# EAGLE schematic eps (EAGLE 9.6.2)

## Sheet 1 of 14
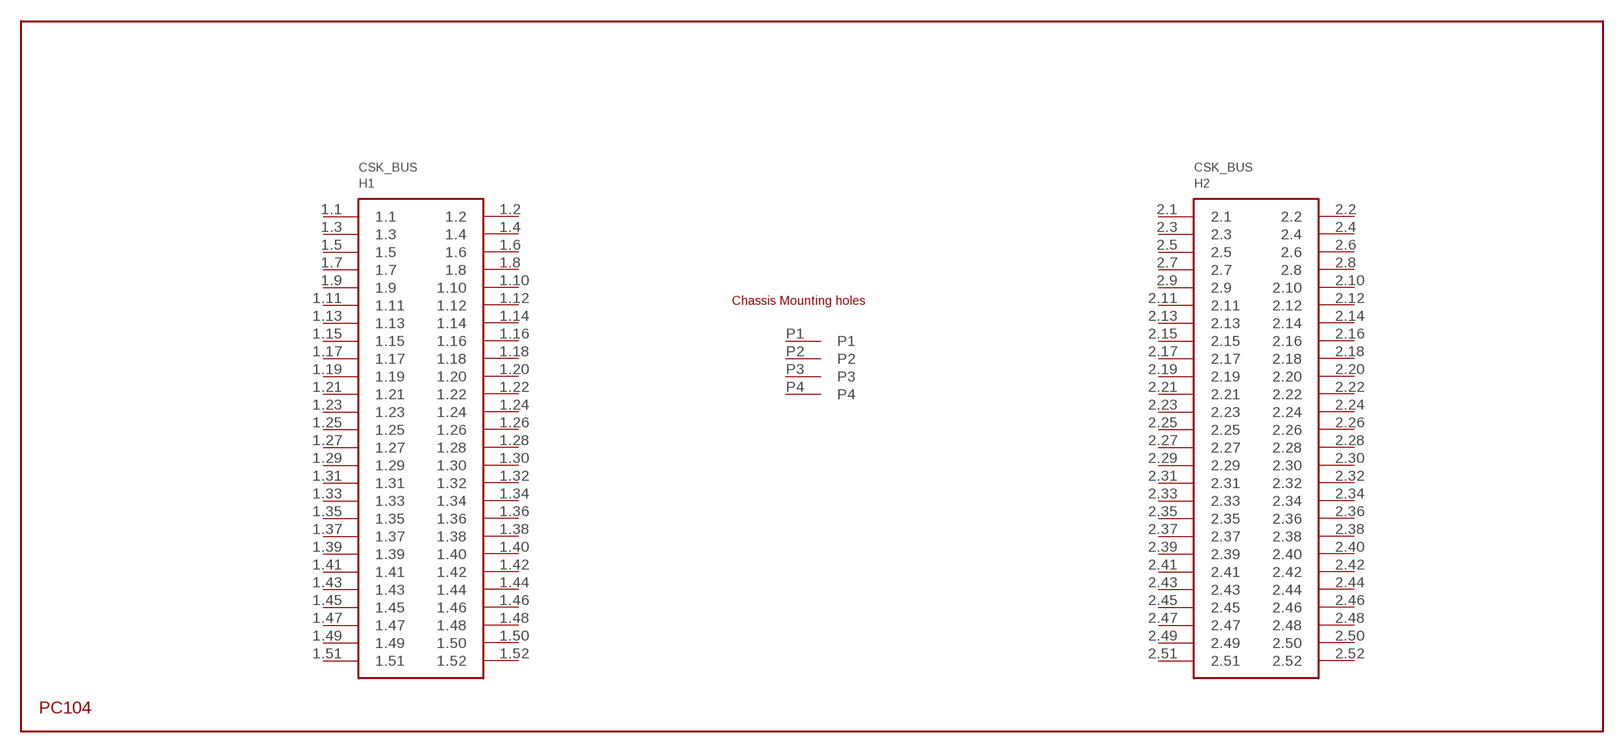
[diagram p0: schematic, sheet 1]

### Parts
H1  PC104_WCONN  [PC104_WCONN]
Unconnected: H1.1.1 H1.1.2 H1.1.3 H1.1.4 H1.1.5 H1.1.6 H1.1.7 H1.1.8 H1.1.9 H1.1.10 H1.1.11 H1.1.12 H1.1.13 H1.1.14 H1.1.15 H1.1.16 H1.1.17 H1.1.18 H1.1.19 H1.1.20 H1.1.21 H1.1.22 H1.1.23 H1.1.24 H1.1.25 H1.1.26 H1.1.27 H1.1.28 H1.1.29 H1.1.30 H1.1.31 H1.1.32 H1.1.33 H1.1.34 H1.1.35 H1.1.36 H1.1.37 H1.1.38 H1.1.39 H1.1.40 H1.1.41 H1.1.42 H1.1.43 H1.1.44 H1.1.45 H1.1.46 H1.1.47 H1.1.48 H1.1.49 H1.1.50 H1.1.51 H1.1.52 H1.2.1 H1.2.2 H1.2.3 H1.2.4 H1.2.5 H1.2.6 H1.2.7 H1.2.8 H1.2.9 H1.2.10 H1.2.11 H1.2.12 H1.2.13 H1.2.14 H1.2.15 H1.2.16 H1.2.17 H1.2.18 H1.2.19 H1.2.20 H1.2.21 H1.2.22 H1.2.23 H1.2.24 H1.2.25 H1.2.26 H1.2.27 H1.2.28 H1.2.29 H1.2.30 H1.2.31 H1.2.32 H1.2.33 H1.2.34 H1.2.35 H1.2.36 H1.2.37 H1.2.38 H1.2.39 H1.2.40 H1.2.41 H1.2.42 H1.2.43 H1.2.44 H1.2.45 H1.2.46 H1.2.47 H1.2.48 H1.2.49 H1.2.50 H1.2.51 H1.2.52 H1.P1 H1.P2 H1.P3 H1.P4

## Sheet 2 of 14
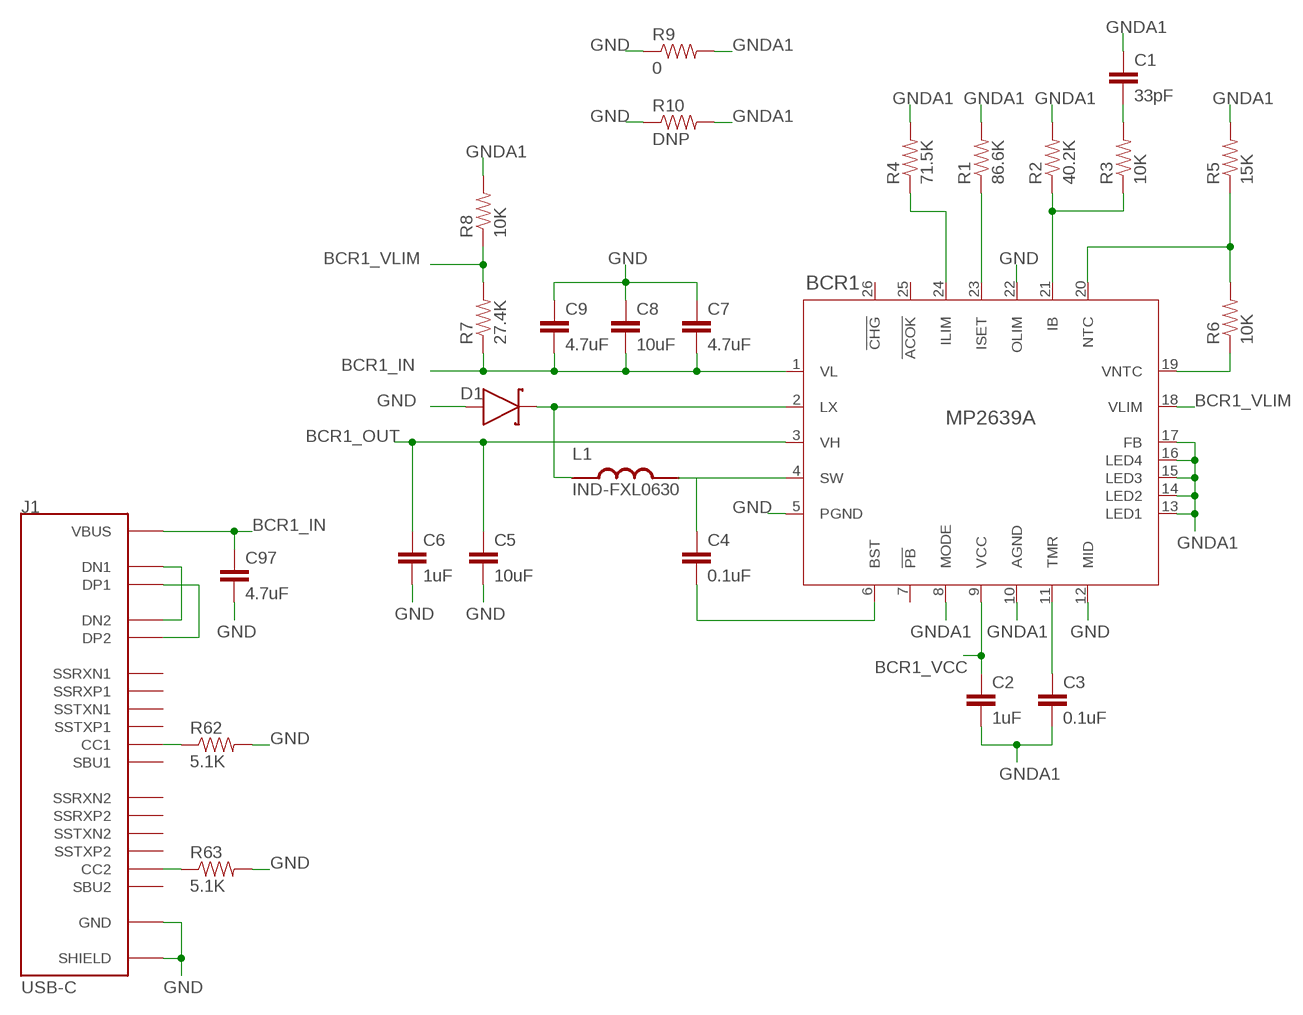
[diagram p1: schematic, sheet 2]

### Parts
BCR1  MP2639A  [IC26_MP2639A_MNP]
C1  33pF  CAP0603-CAP  [0603-CAP]
C2  1uF  CAP0603-CAP  [0603-CAP]
C3  0.1uF  CAP0603-CAP  [0603-CAP]
C4  0.1uF  CAP0603-CAP  [0603-CAP]
C5  10uF  CAP0603-CAP  [0603-CAP]
C6  1uF  CAP0603-CAP  [0603-CAP]
C7  4.7uF  CAP0603-CAP  [0603-CAP]
C8  10uF  CAP0603-CAP  [0603-CAP]
C9  4.7uF  CAP0603-CAP  [0603-CAP]
C97  4.7uF  CAP0603-CAP  [0603-CAP]
D1  DIODE-SOD123  [SOD123]
J1  USB-C  [CUI_UJ31-CH-G1-SMT-TR]
L1  IND-FXL0630  [FXL0630]
R1  86.6K  RESISTOR0603-RES  [0603-RES]
R2  40.2K  RESISTOR0603-RES  [0603-RES]
R3  10K  RESISTOR0603-RES  [0603-RES]
R4  71.5K  RESISTOR0603-RES  [0603-RES]
R5  15K  RESISTOR0603-RES  [0603-RES]
R6  10K  RESISTOR0603-RES  [0603-RES]
R7  27.4K  RESISTOR0603-RES  [0603-RES]
R8  10K  RESISTOR0603-RES  [0603-RES]
R9  0  RESISTOR0603-RES  [0603-RES]
R10  DNP  RESISTOR0603-RES  [0603-RES]
R62  5.1K  RESISTOR0603-RES  [0603-RES]
R63  5.1K  RESISTOR0603-RES  [0603-RES]

### Nets
BCR1_BST: BCR1.6(BST) C4.2
BCR1_C1-R3: C1.2 R3.2
BCR1_IB: BCR1.21(IB) R2.1 R3.1
BCR1_ILIM: BCR1.24(ILIM) R4.1
BCR1_IN: BCR1.1(VL) C7.2 C8.2 C9.2 C97.1 J1.A4(VBUS) J1.A9(VBUS) J1.B4(VBUS) J1.B9(VBUS) R7.1 ; also sheet 3
BCR1_ISET: BCR1.23(ISET) R1.1
BCR1_LX: BCR1.2(LX) D1.1 L1.1
BCR1_NTC: BCR1.20(NTC) R5.1 R6.2
BCR1_OUT: BCR1.3(VH) C5.1 C6.1
BCR1_SW: BCR1.4(SW) C4.1 L1.2
BCR1_TMR: BCR1.11(TMR) C3.1
BCR1_VCC: BCR1.9(VCC) C2.1
BCR1_VLIM: BCR1.18(VLIM) R7.2 R8.1
BCR1_VNTC: BCR1.19(VNTC) R6.1
GND: BCR1.5(PGND) BCR1.12(MID) BCR1.22(OLIM) C5.2 C6.2 C7.1 C8.1 C9.1 C97.2 D1.2 J1.A1(GND) J1.A12(GND) J1.B1(GND) J1.B12(GND) J1.SH1(SHIELD) J1.SH2(SHIELD) J1.SH3(SHIELD) J1.SH4(SHIELD) J1.SH5(SHIELD) J1.SH6(SHIELD) R9.1 R10.1 R62.2 R63.2 ; also sheet 3,4,5,6,7,8,9,10,11,12,13,14
GNDA1: BCR1.8(MODE) BCR1.10(AGND) BCR1.13(LED1) BCR1.14(LED2) BCR1.15(LED3) BCR1.16(LED4) BCR1.17(FB) C1.1 C2.2 C3.2 R1.2 R2.2 R4.2 R5.2 R8.2 R9.2 R10.2
J1_CC1: J1.A5(CC1) R62.1
J1_CC2: J1.B5(CC2) R63.1
J1_DN: J1.A7(DN1) J1.B7(DN2)
J1_DP: J1.A6(DP1) J1.B6(DP2)
Unconnected: BCR1.7(!PB) BCR1.25(!ACOK) BCR1.26(!CHG) J1.A2(SSTXP1) J1.A3(SSTXN1) J1.A8(SBU1) J1.A10(SSRXN2) J1.A11(SSRXP2) J1.B2(SSTXP2) J1.B3(SSTXN2) J1.B8(SBU2) J1.B10(SSRXN1) J1.B11(SSRXP1)

## Sheet 3 of 14
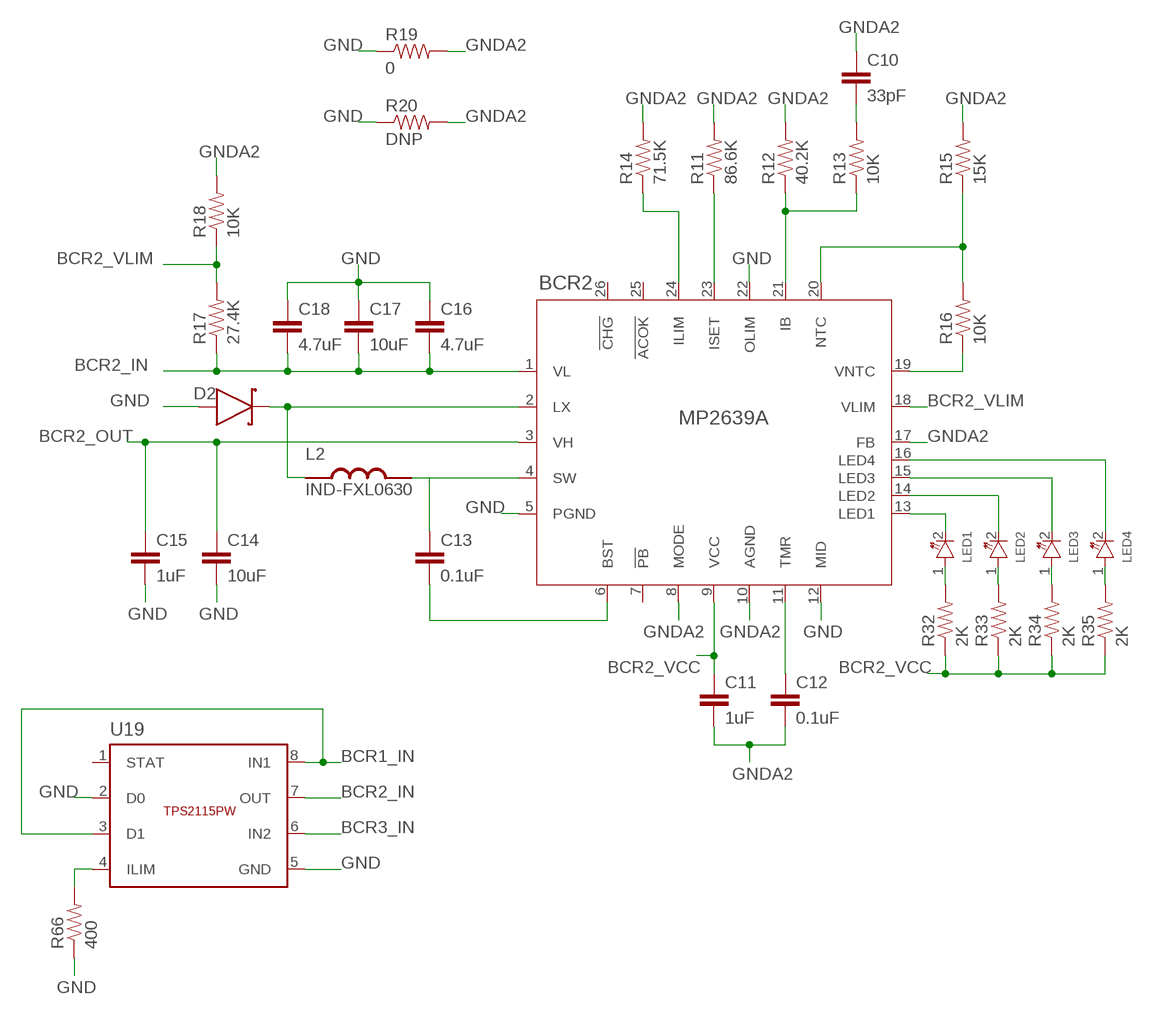
[diagram p2: schematic, sheet 3]

### Parts
BCR2  MP2639A  [IC26_MP2639A_MNP]
C10  33pF  CAP0603-CAP  [0603-CAP]
C11  1uF  CAP0603-CAP  [0603-CAP]
C12  0.1uF  CAP0603-CAP  [0603-CAP]
C13  0.1uF  CAP0603-CAP  [0603-CAP]
C14  10uF  CAP0603-CAP  [0603-CAP]
C15  1uF  CAP0603-CAP  [0603-CAP]
C16  4.7uF  CAP0603-CAP  [0603-CAP]
C17  10uF  CAP0603-CAP  [0603-CAP]
C18  4.7uF  CAP0603-CAP  [0603-CAP]
D2  DIODE-SOD123  [SOD123]
L2  IND-FXL0630  [FXL0630]
LED1  LED_0805  [LED_0805]
LED2  LED_0805  [LED_0805]
LED3  LED_0805  [LED_0805]
LED4  LED_0805  [LED_0805]
R11  86.6K  RESISTOR0603-RES  [0603-RES]
R12  40.2K  RESISTOR0603-RES  [0603-RES]
R13  10K  RESISTOR0603-RES  [0603-RES]
R14  71.5K  RESISTOR0603-RES  [0603-RES]
R15  15K  RESISTOR0603-RES  [0603-RES]
R16  10K  RESISTOR0603-RES  [0603-RES]
R17  27.4K  RESISTOR0603-RES  [0603-RES]
R18  10K  RESISTOR0603-RES  [0603-RES]
R19  0  RESISTOR0603-RES  [0603-RES]
R20  DNP  RESISTOR0603-RES  [0603-RES]
R32  2K  RESISTOR0603-RES  [0603-RES]
R33  2K  RESISTOR0603-RES  [0603-RES]
R34  2K  RESISTOR0603-RES  [0603-RES]
R35  2K  RESISTOR0603-RES  [0603-RES]
R66  400  RESISTOR0603-RES  [0603-RES]
U19  TPS2115PW  [TTSOP-8]

### Nets
BCR1_IN: U19.3(D1) U19.8(IN1) ; also sheet 2
BCR2_BST: BCR2.6(BST) C13.2
BCR2_C10-R13: C10.2 R13.2
BCR2_IB2: BCR2.21(IB) R12.1 R13.1
BCR2_ILIM: BCR2.24(ILIM) R14.1
BCR2_IN: BCR2.1(VL) C16.2 C17.2 C18.2 R17.1 U19.7(OUT)
BCR2_ISET: BCR2.23(ISET) R11.1
BCR2_LED1: BCR2.13(LED1) LED1.2
BCR2_LED2: BCR2.14(LED2) LED2.2
BCR2_LED3: BCR2.15(LED3) LED3.2
BCR2_LED4: BCR2.16(LED4) LED4.2
BCR2_LX: BCR2.2(LX) D2.1 L2.1
BCR2_NTC: BCR2.20(NTC) R15.1 R16.2
BCR2_OUT: BCR2.3(VH) C14.1 C15.1
BCR2_SW: BCR2.4(SW) C13.1 L2.2
BCR2_TMR: BCR2.11(TMR) C12.1
BCR2_VCC: BCR2.9(VCC) C11.1 R32.1 R33.1 R34.1 R35.1
BCR2_VLIM: BCR2.18(VLIM) R17.2 R18.1
BCR2_VNTC: BCR2.19(VNTC) R16.1
BCR3_IN: U19.6(IN2) ; also sheet 4
GND: BCR2.5(PGND) BCR2.12(MID) BCR2.22(OLIM) C14.2 C15.2 C16.1 C17.1 C18.1 D2.2 R19.1 R20.1 R66.1 U19.2(D0) U19.5(GND) ; also sheet 2,4,5,6,7,8,9,10,11,12,13,14
GNDA2: BCR2.8(MODE) BCR2.10(AGND) BCR2.17(FB) C10.1 C11.2 C12.2 R11.2 R12.2 R14.2 R15.2 R18.2 R19.2 R20.2
LED1: LED1.1 R32.2
LED2: LED2.1 R33.2
LED3: LED3.1 R34.2
LED4: LED4.1 R35.2
U19_ILIM: R66.2 U19.4(ILIM)
Unconnected: BCR2.7(!PB) BCR2.25(!ACOK) BCR2.26(!CHG) U19.1(STAT)

## Sheet 4 of 14
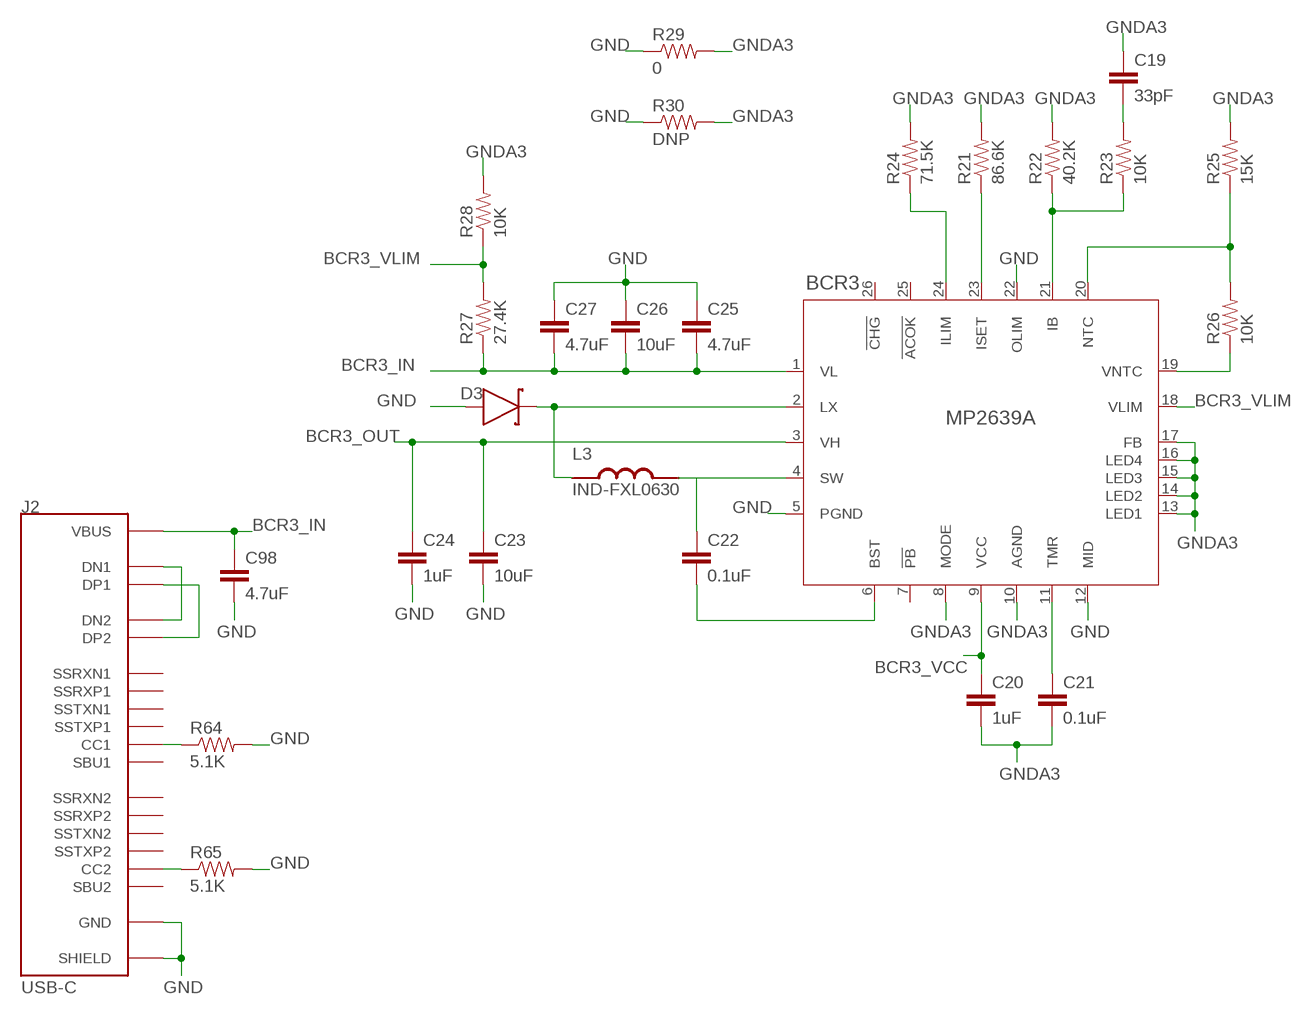
[diagram p3: schematic, sheet 4]

### Parts
BCR3  MP2639A  [IC26_MP2639A_MNP]
C19  33pF  CAP0603-CAP  [0603-CAP]
C20  1uF  CAP0603-CAP  [0603-CAP]
C21  0.1uF  CAP0603-CAP  [0603-CAP]
C22  0.1uF  CAP0603-CAP  [0603-CAP]
C23  10uF  CAP0603-CAP  [0603-CAP]
C24  1uF  CAP0603-CAP  [0603-CAP]
C25  4.7uF  CAP0603-CAP  [0603-CAP]
C26  10uF  CAP0603-CAP  [0603-CAP]
C27  4.7uF  CAP0603-CAP  [0603-CAP]
C98  4.7uF  CAP0603-CAP  [0603-CAP]
D3  DIODE-SOD123  [SOD123]
J2  USB-C  [CUI_UJ31-CH-G1-SMT-TR]
L3  IND-FXL0630  [FXL0630]
R21  86.6K  RESISTOR0603-RES  [0603-RES]
R22  40.2K  RESISTOR0603-RES  [0603-RES]
R23  10K  RESISTOR0603-RES  [0603-RES]
R24  71.5K  RESISTOR0603-RES  [0603-RES]
R25  15K  RESISTOR0603-RES  [0603-RES]
R26  10K  RESISTOR0603-RES  [0603-RES]
R27  27.4K  RESISTOR0603-RES  [0603-RES]
R28  10K  RESISTOR0603-RES  [0603-RES]
R29  0  RESISTOR0603-RES  [0603-RES]
R30  DNP  RESISTOR0603-RES  [0603-RES]
R64  5.1K  RESISTOR0603-RES  [0603-RES]
R65  5.1K  RESISTOR0603-RES  [0603-RES]

### Nets
BCR3_BST: BCR3.6(BST) C22.2
BCR3_C19-R23: C19.2 R23.2
BCR3_IB: BCR3.21(IB) R22.1 R23.1
BCR3_ILIM: BCR3.24(ILIM) R24.1
BCR3_IN: BCR3.1(VL) C25.2 C26.2 C27.2 C98.1 J2.A4(VBUS) J2.A9(VBUS) J2.B4(VBUS) J2.B9(VBUS) R27.1 ; also sheet 3
BCR3_ISET: BCR3.23(ISET) R21.1
BCR3_LX: BCR3.2(LX) D3.1 L3.1
BCR3_NTC: BCR3.20(NTC) R25.1 R26.2
BCR3_OUT: BCR3.3(VH) C23.1 C24.1
BCR3_SW: BCR3.4(SW) C22.1 L3.2
BCR3_TMR: BCR3.11(TMR) C21.1
BCR3_VCC: BCR3.9(VCC) C20.1
BCR3_VLIM: BCR3.18(VLIM) R27.2 R28.1
BCR3_VNTC: BCR3.19(VNTC) R26.1
GND: BCR3.5(PGND) BCR3.12(MID) BCR3.22(OLIM) C23.2 C24.2 C25.1 C26.1 C27.1 C98.2 D3.2 J2.A1(GND) J2.A12(GND) J2.B1(GND) J2.B12(GND) J2.SH1(SHIELD) J2.SH2(SHIELD) J2.SH3(SHIELD) J2.SH4(SHIELD) J2.SH5(SHIELD) J2.SH6(SHIELD) R29.1 R30.1 R64.2 R65.2 ; also sheet 2,3,5,6,7,8,9,10,11,12,13,14
GNDA3: BCR3.8(MODE) BCR3.10(AGND) BCR3.13(LED1) BCR3.14(LED2) BCR3.15(LED3) BCR3.16(LED4) BCR3.17(FB) C19.1 C20.2 C21.2 R21.2 R22.2 R24.2 R25.2 R28.2 R29.2 R30.2
J2_CC1: J2.A5(CC1) R64.1
J2_CC2: J2.B5(CC2) R65.1
J2_DN: J2.A7(DN1) J2.B7(DN2)
J2_DP: J2.A6(DP1) J2.B6(DP2)
Unconnected: BCR3.7(!PB) BCR3.25(!ACOK) BCR3.26(!CHG) J2.A2(SSTXP1) J2.A3(SSTXN1) J2.A8(SBU1) J2.A10(SSRXN2) J2.A11(SSRXP2) J2.B2(SSTXP2) J2.B3(SSTXN2) J2.B8(SBU2) J2.B10(SSRXN1) J2.B11(SSRXP1)

## Sheet 5 of 14
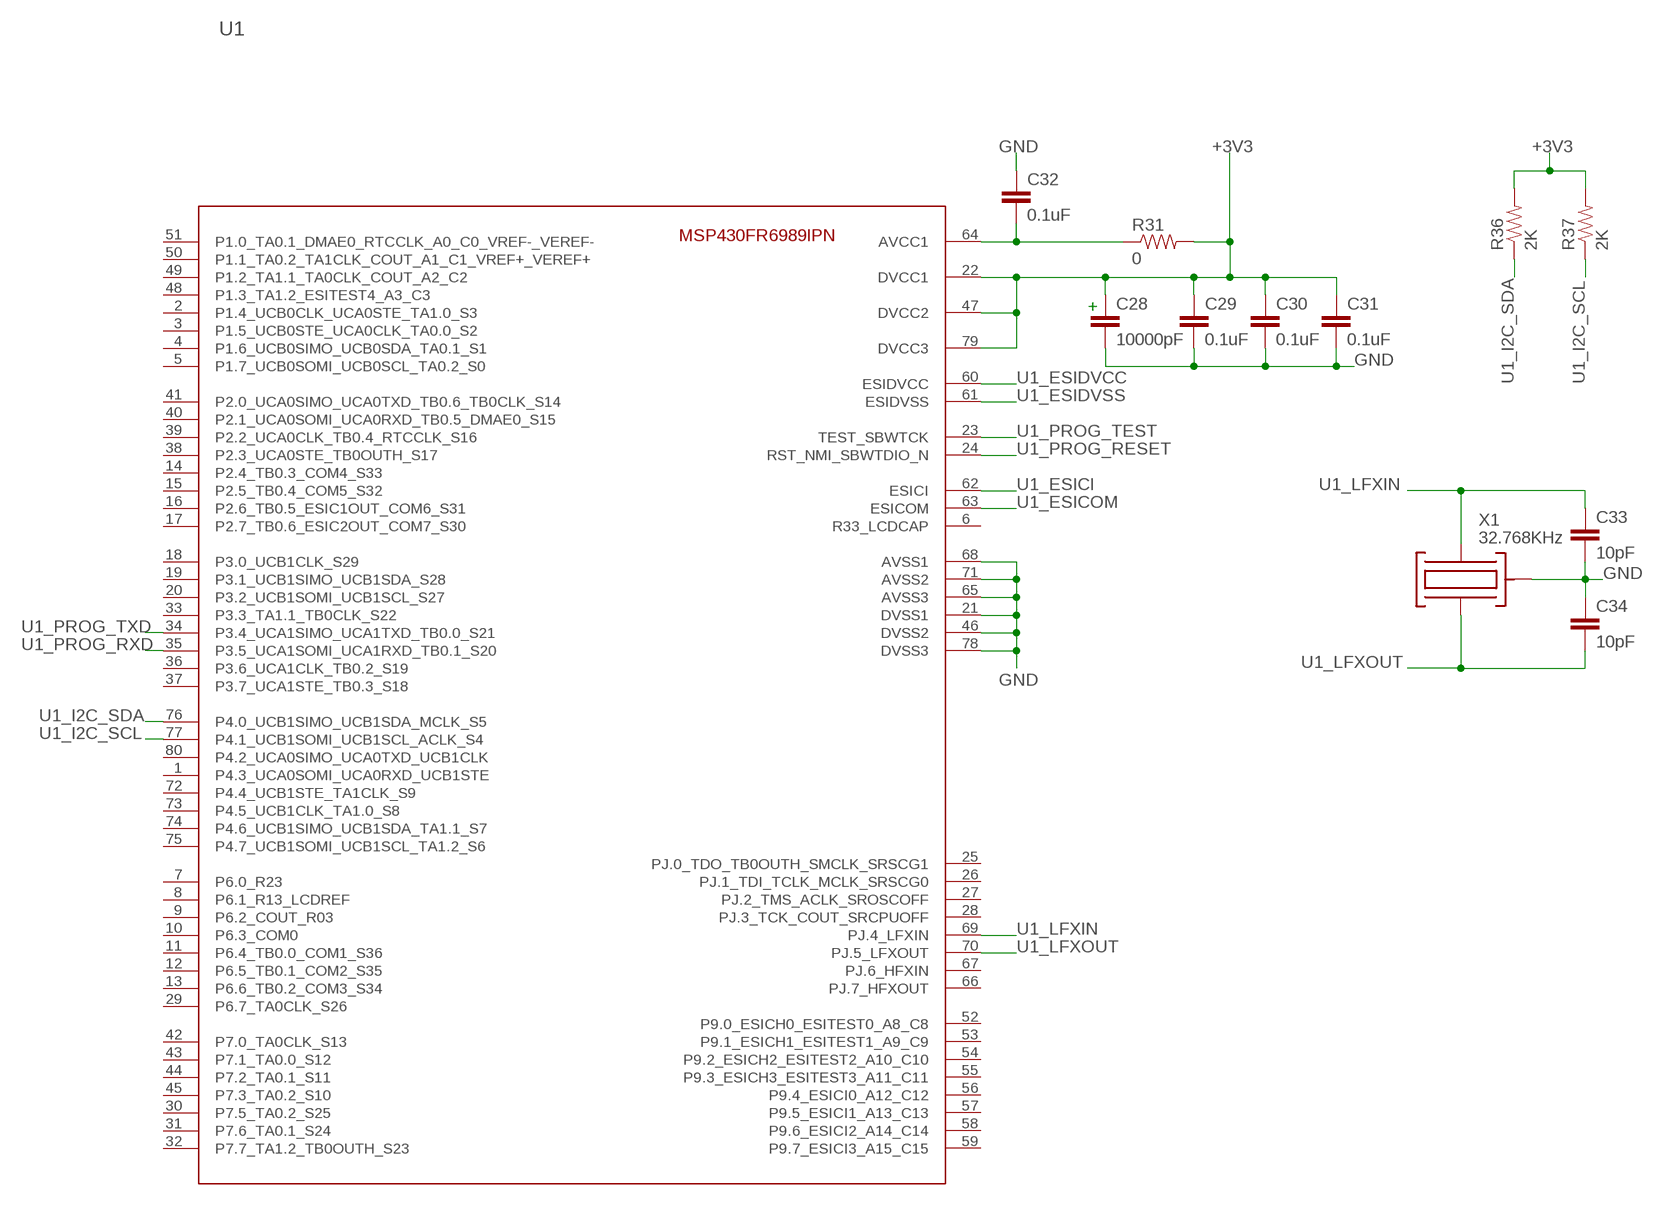
[diagram p4: schematic, sheet 5]

### Parts
C28  10000pF  CAP0805  [0805]
C29  0.1uF  CAP0603-CAP  [0603-CAP]
C30  0.1uF  CAP0603-CAP  [0603-CAP]
C31  0.1uF  CAP0603-CAP  [0603-CAP]
C32  0.1uF  CAP0603-CAP  [0603-CAP]
C33  10pF  CAP0603-CAP  [0603-CAP]
C34  10pF  CAP0603-CAP  [0603-CAP]
R31  0  RESISTOR0603-RES  [0603-RES]
R36  2K  RESISTOR0603-RES  [0603-RES]
R37  2K  RESISTOR0603-RES  [0603-RES]
U1  MSP430FR6989IPN  [PN0080A_N]
X1  32.768KHz  MS3V-T1R  [MS3V-T1R]

### Nets
+3V3: C28.1 C29.1 C30.1 C31.1 R31.2 R36.2 R37.2 U1.22(DVCC1) U1.47(DVCC2) U1.79(DVCC3) ; also sheet 6
GND: C28.2 C29.2 C30.2 C31.2 C32.1 C33.2 C34.1 U1.21(DVSS1) U1.46(DVSS2) U1.65(AVSS3) U1.68(AVSS1) U1.71(AVSS2) U1.78(DVSS3) X1.3 ; also sheet 2,3,4,6,7,8,9,10,11,12,13,14
N$3: C32.2 R31.1 U1.64(AVCC1)
U1_ESICI: U1.62(ESICI)
U1_ESICOM: U1.63(ESICOM)
U1_ESIDVCC: U1.60(ESIDVCC)
U1_ESIDVSS: U1.61(ESIDVSS)
U1_I2C_SCL: R37.1 U1.77(P4.1_UCB1SOMI_UCB1SCL_ACLK_S4)
U1_I2C_SDA: R36.1 U1.76(P4.0_UCB1SIMO_UCB1SDA_MCLK_S5)
U1_LFXIN: C33.1 U1.69(PJ.4_LFXIN) X1.1
U1_LFXOUT: C34.2 U1.70(PJ.5_LFXOUT) X1.2
U1_PROG_RESET: U1.24(RST_NMI_SBWTDIO_N)
U1_PROG_RXD: U1.35(P3.5_UCA1SOMI_UCA1RXD_TB0.1_S20)
U1_PROG_TEST: U1.23(TEST_SBWTCK)
U1_PROG_TXD: U1.34(P3.4_UCA1SIMO_UCA1TXD_TB0.0_S21)
Unconnected: U1.1(P4.3_UCA0SOMI_UCA0RXD_UCB1STE) U1.2(P1.4_UCB0CLK_UCA0STE_TA1.0_S3) U1.3(P1.5_UCB0STE_UCA0CLK_TA0.0_S2) U1.4(P1.6_UCB0SIMO_UCB0SDA_TA0.1_S1) U1.5(P1.7_UCB0SOMI_UCB0SCL_TA0.2_S0) U1.6(R33_LCDCAP) U1.7(P6.0_R23) U1.8(P6.1_R13_LCDREF) U1.9(P6.2_COUT_R03) U1.10(P6.3_COM0) U1.11(P6.4_TB0.0_COM1_S36) U1.12(P6.5_TB0.1_COM2_S35) U1.13(P6.6_TB0.2_COM3_S34) U1.14(P2.4_TB0.3_COM4_S33) U1.15(P2.5_TB0.4_COM5_S32) U1.16(P2.6_TB0.5_ESIC1OUT_COM6_S31) U1.17(P2.7_TB0.6_ESIC2OUT_COM7_S30) U1.18(P3.0_UCB1CLK_S29) U1.19(P3.1_UCB1SIMO_UCB1SDA_S28) U1.20(P3.2_UCB1SOMI_UCB1SCL_S27) U1.25(PJ.0_TDO_TB0OUTH_SMCLK_SRSCG1) U1.26(PJ.1_TDI_TCLK_MCLK_SRSCG0) U1.27(PJ.2_TMS_ACLK_SROSCOFF) U1.28(PJ.3_TCK_COUT_SRCPUOFF) U1.29(P6.7_TA0CLK_S26) U1.30(P7.5_TA0.2_S25) U1.31(P7.6_TA0.1_S24) U1.32(P7.7_TA1.2_TB0OUTH_S23) U1.33(P3.3_TA1.1_TB0CLK_S22) U1.36(P3.6_UCA1CLK_TB0.2_S19) U1.37(P3.7_UCA1STE_TB0.3_S18) U1.38(P2.3_UCA0STE_TB0OUTH_S17) U1.39(P2.2_UCA0CLK_TB0.4_RTCCLK_S16) U1.40(P2.1_UCA0SOMI_UCA0RXD_TB0.5_DMAE0_S15) U1.41(P2.0_UCA0SIMO_UCA0TXD_TB0.6_TB0CLK_S14) U1.42(P7.0_TA0CLK_S13) U1.43(P7.1_TA0.0_S12) U1.44(P7.2_TA0.1_S11) U1.45(P7.3_TA0.2_S10) U1.48(P1.3_TA1.2_ESITEST4_A3_C3) U1.49(P1.2_TA1.1_TA0CLK_COUT_A2_C2) U1.50(P1.1_TA0.2_TA1CLK_COUT_A1_C1_VREF+_VEREF+) U1.51(P1.0_TA0.1_DMAE0_RTCCLK_A0_C0_VREF-_VEREF-) U1.52(P9.0_ESICH0_ESITEST0_A8_C8) U1.53(P9.1_ESICH1_ESITEST1_A9_C9) U1.54(P9.2_ESICH2_ESITEST2_A10_C10) U1.55(P9.3_ESICH3_ESITEST3_A11_C11) U1.56(P9.4_ESICI0_A12_C12) U1.57(P9.5_ESICI1_A13_C13) U1.58(P9.6_ESICI2_A14_C14) U1.59(P9.7_ESICI3_A15_C15) U1.66(PJ.7_HFXOUT) U1.67(PJ.6_HFXIN) U1.72(P4.4_UCB1STE_TA1CLK_S9) U1.73(P4.5_UCB1CLK_TA1.0_S8) U1.74(P4.6_UCB1SIMO_UCB1SDA_TA1.1_S7) U1.75(P4.7_UCB1SOMI_UCB1SCL_TA1.2_S6) U1.80(P4.2_UCA0SIMO_UCA0TXD_UCB1CLK)

### Notes on the sheet
- +

## Sheet 6 of 14
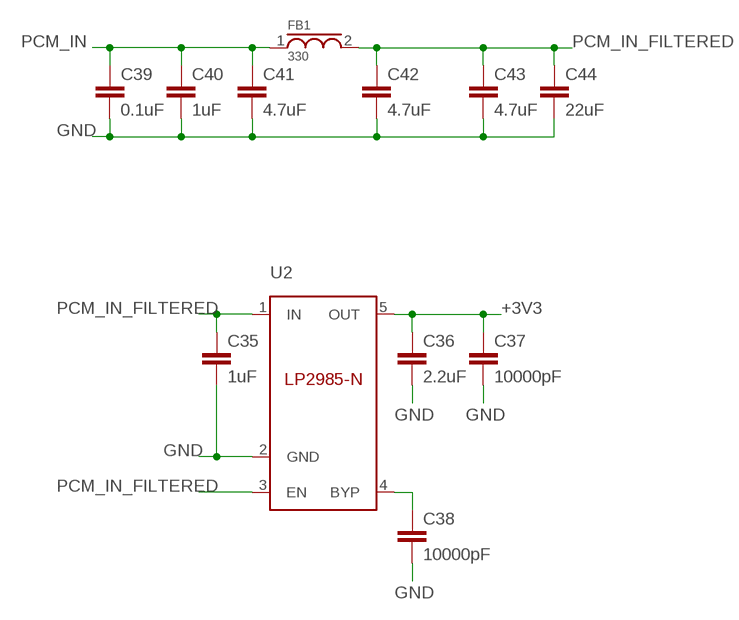
[diagram p5: schematic, sheet 6]

### Parts
C35  1uF  CAP0603-CAP  [0603-CAP]
C36  2.2uF  CAP0603-CAP  [0603-CAP]
C37  10000pF  CAP0603-CAP  [0603-CAP]
C38  10000pF  CAP0603-CAP  [0603-CAP]
C39  0.1uF  CAP0603-CAP  [0603-CAP]
C40  1uF  CAP0603-CAP  [0603-CAP]
C41  4.7uF  CAP1206  [1206]
C42  4.7uF  CAP1206  [1206]
C43  4.7uF  CAP1206  [1206]
C44  22uF  CAP_TANTALUM  [2917]
FB1  330  FB0805  [0805]
U2  LP2985-N  [SOT23-5]

### Nets
+3V3: C36.1 C37.1 U2.5(OUT) ; also sheet 5
GND: C35.2 C36.2 C37.2 C38.2 C39.2 C40.2 C41.2 C42.2 C43.2 C44.2 U2.2(GND) ; also sheet 2,3,4,5,7,8,9,10,11,12,13,14
N$4: C38.1 U2.4(BYP)
PCM_IN: C39.1 C40.1 C41.1 FB1.1
PCM_IN_FILTERED: C35.1 C42.1 C43.1 C44.1 FB1.2 U2.1(IN) U2.3(EN) ; also sheet 7,8,9,10,11,12

## Sheet 7 of 14
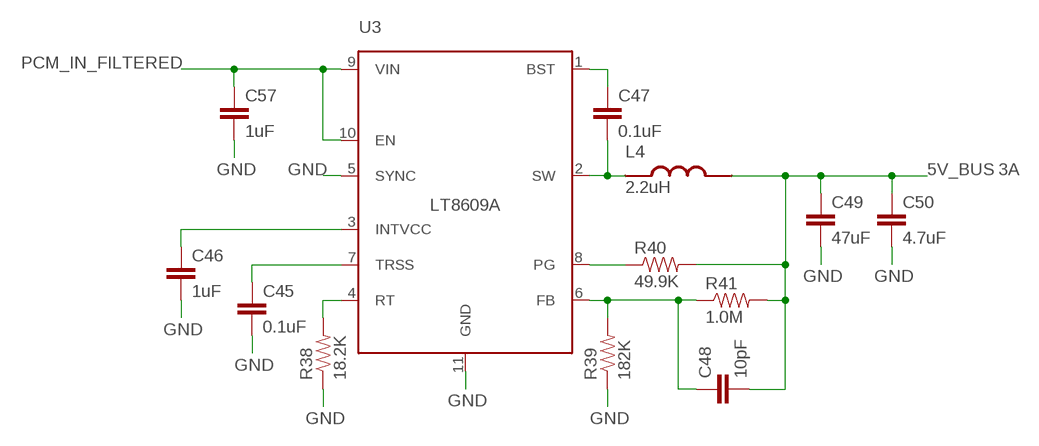
[diagram p6: schematic, sheet 7]

### Parts
C45  0.1uF  CAP0603-CAP  [0603-CAP]
C46  1uF  CAP0603-CAP  [0603-CAP]
C47  0.1uF  CAP0603-CAP  [0603-CAP]
C48  10pF  CAP0603-CAP  [0603-CAP]
C49  47uF  CAP0805  [0805]
C50  4.7uF  CAP0603-CAP  [0603-CAP]
C57  1uF  CAP0603-CAP  [0603-CAP]
L4  2.2uH  IND-XFL4020  [XFL4020]
R38  18.2K  RESISTOR0603-RES  [0603-RES]
R39  182K  RESISTOR0603-RES  [0603-RES]
R40  49.9K  RESISTOR0603-RES  [0603-RES]
R41  1.0M  RESISTOR0603-RES  [0603-RES]
U3  LT8609A  [MSOP-10_MSE]

### Nets
5V_BUS: C48.2 C49.1 C50.1 L4.2 R40.2 R41.2 ; also sheet 8,9,13
GND: C45.2 C46.2 C49.2 C50.2 C57.2 R38.1 R39.1 U3.5(SYNC) U3.11(GND) ; also sheet 2,3,4,5,6,8,9,10,11,12,13,14
PCM_IN_FILTERED: C57.1 U3.9(VIN) U3.10(EN) ; also sheet 6,8,9,10,11,12
U3_BST: C47.1 U3.1(BST)
U3_FB: C48.1 R39.2 R41.1 U3.6(FB)
U3_INTVCC: C46.1 U3.3(INTVCC)
U3_PG: R40.1 U3.8(PG)
U3_RT: R38.2 U3.4(RT)
U3_SW: C47.2 L4.1 U3.2(SW)
U3_TRSS: C45.1 U3.7(TRSS)

### Notes on the sheet
- 3A

## Sheet 8 of 14
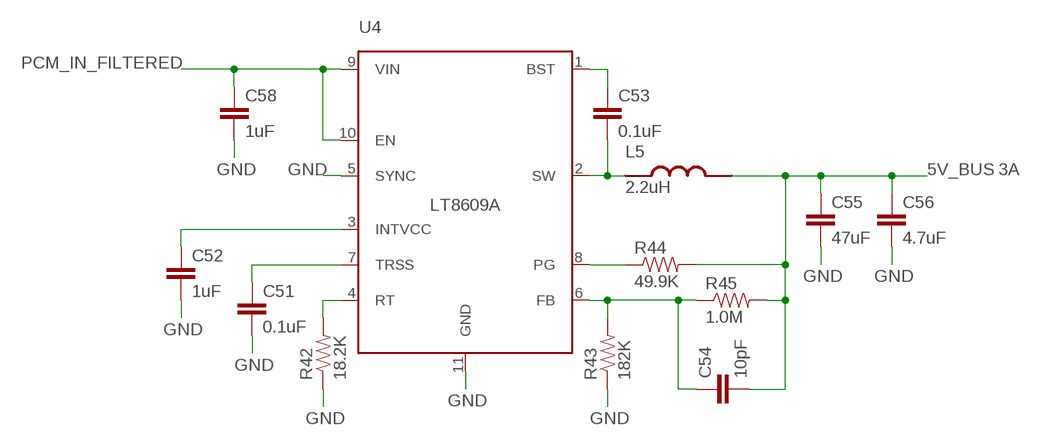
[diagram p7: schematic, sheet 8]

### Parts
C51  0.1uF  CAP0603-CAP  [0603-CAP]
C52  1uF  CAP0603-CAP  [0603-CAP]
C53  0.1uF  CAP0603-CAP  [0603-CAP]
C54  10pF  CAP0603-CAP  [0603-CAP]
C55  47uF  CAP0805  [0805]
C56  4.7uF  CAP0603-CAP  [0603-CAP]
C58  1uF  CAP0603-CAP  [0603-CAP]
L5  2.2uH  IND-XFL4020  [XFL4020]
R42  18.2K  RESISTOR0603-RES  [0603-RES]
R43  182K  RESISTOR0603-RES  [0603-RES]
R44  49.9K  RESISTOR0603-RES  [0603-RES]
R45  1.0M  RESISTOR0603-RES  [0603-RES]
U4  LT8609A  [MSOP-10_MSE]

### Nets
5V_BUS: C54.2 C55.1 C56.1 L5.2 R44.2 R45.2 ; also sheet 7,9,13
GND: C51.2 C52.2 C55.2 C56.2 C58.2 R42.1 R43.1 U4.5(SYNC) U4.11(GND) ; also sheet 2,3,4,5,6,7,9,10,11,12,13,14
PCM_IN_FILTERED: C58.1 U4.9(VIN) U4.10(EN) ; also sheet 6,7,9,10,11,12
U4_BST: C53.1 U4.1(BST)
U4_FB: C54.1 R43.2 R45.1 U4.6(FB)
U4_INTVCC: C52.1 U4.3(INTVCC)
U4_PG: R44.1 U4.8(PG)
U4_RT: R42.2 U4.4(RT)
U4_SW: C53.2 L5.1 U4.2(SW)
U4_TRSS: C51.1 U4.7(TRSS)

### Notes on the sheet
- 3A

## Sheet 9 of 14
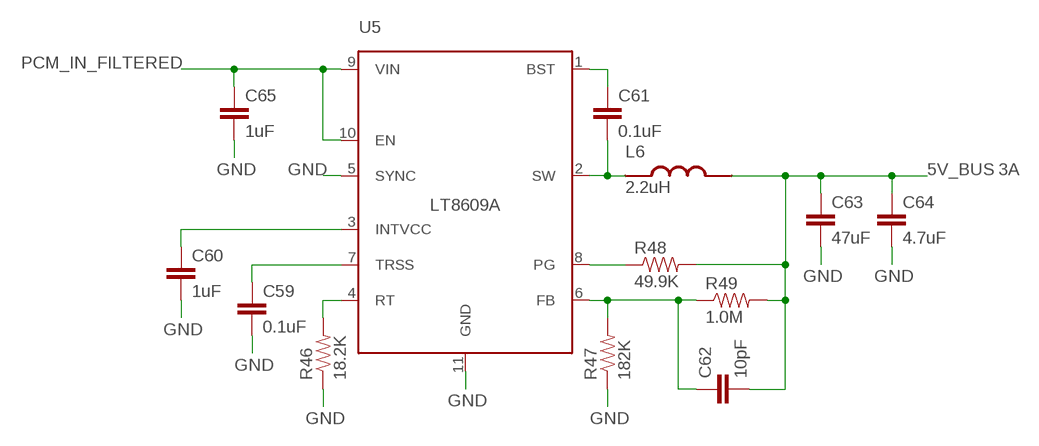
[diagram p8: schematic, sheet 9]

### Parts
C59  0.1uF  CAP0603-CAP  [0603-CAP]
C60  1uF  CAP0603-CAP  [0603-CAP]
C61  0.1uF  CAP0603-CAP  [0603-CAP]
C62  10pF  CAP0603-CAP  [0603-CAP]
C63  47uF  CAP0805  [0805]
C64  4.7uF  CAP0603-CAP  [0603-CAP]
C65  1uF  CAP0603-CAP  [0603-CAP]
L6  2.2uH  IND-XFL4020  [XFL4020]
R46  18.2K  RESISTOR0603-RES  [0603-RES]
R47  182K  RESISTOR0603-RES  [0603-RES]
R48  49.9K  RESISTOR0603-RES  [0603-RES]
R49  1.0M  RESISTOR0603-RES  [0603-RES]
U5  LT8609A  [MSOP-10_MSE]

### Nets
5V_BUS: C62.2 C63.1 C64.1 L6.2 R48.2 R49.2 ; also sheet 7,8,13
GND: C59.2 C60.2 C63.2 C64.2 C65.2 R46.1 R47.1 U5.5(SYNC) U5.11(GND) ; also sheet 2,3,4,5,6,7,8,10,11,12,13,14
PCM_IN_FILTERED: C65.1 U5.9(VIN) U5.10(EN) ; also sheet 6,7,8,10,11,12
U5_BST: C61.1 U5.1(BST)
U5_FB: C62.1 R47.2 R49.1 U5.6(FB)
U5_INTVCC: C60.1 U5.3(INTVCC)
U5_PG: R48.1 U5.8(PG)
U5_RT: R46.2 U5.4(RT)
U5_SW: C61.2 L6.1 U5.2(SW)
U5_TRSS: C59.1 U5.7(TRSS)

### Notes on the sheet
- 3A

## Sheet 10 of 14
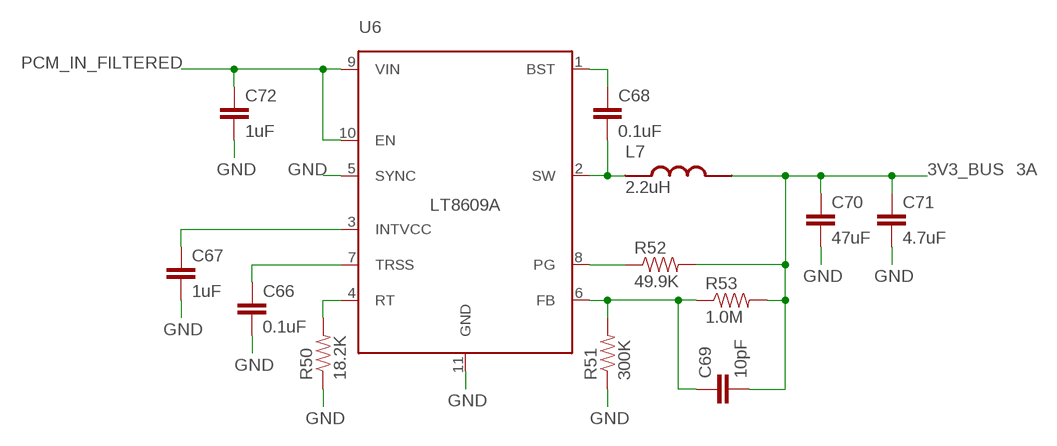
[diagram p9: schematic, sheet 10]

### Parts
C66  0.1uF  CAP0603-CAP  [0603-CAP]
C67  1uF  CAP0603-CAP  [0603-CAP]
C68  0.1uF  CAP0603-CAP  [0603-CAP]
C69  10pF  CAP0603-CAP  [0603-CAP]
C70  47uF  CAP0805  [0805]
C71  4.7uF  CAP0603-CAP  [0603-CAP]
C72  1uF  CAP0603-CAP  [0603-CAP]
L7  2.2uH  IND-XFL4020  [XFL4020]
R50  18.2K  RESISTOR0603-RES  [0603-RES]
R51  300K  RESISTOR0603-RES  [0603-RES]
R52  49.9K  RESISTOR0603-RES  [0603-RES]
R53  1.0M  RESISTOR0603-RES  [0603-RES]
U6  LT8609A  [MSOP-10_MSE]

### Nets
3V3_BUS: C69.2 C70.1 C71.1 L7.2 R52.2 R53.2 ; also sheet 11,12,14
GND: C66.2 C67.2 C70.2 C71.2 C72.2 R50.1 R51.1 U6.5(SYNC) U6.11(GND) ; also sheet 2,3,4,5,6,7,8,9,11,12,13,14
PCM_IN_FILTERED: C72.1 U6.9(VIN) U6.10(EN) ; also sheet 6,7,8,9,11,12
U6_BST: C68.1 U6.1(BST)
U6_FB: C69.1 R51.2 R53.1 U6.6(FB)
U6_INTVCC: C67.1 U6.3(INTVCC)
U6_PG: R52.1 U6.8(PG)
U6_RT: R50.2 U6.4(RT)
U6_SW: C68.2 L7.1 U6.2(SW)
U6_TRSS: C66.1 U6.7(TRSS)

### Notes on the sheet
- 3A

## Sheet 11 of 14
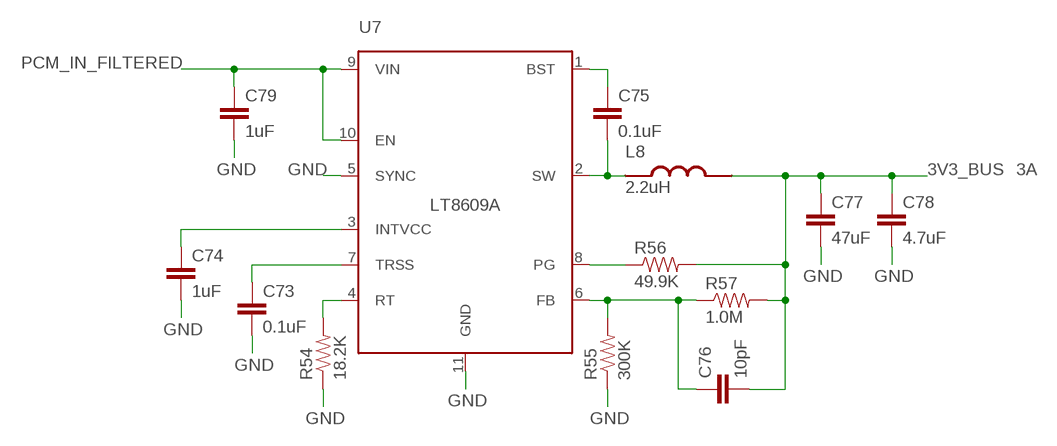
[diagram p10: schematic, sheet 11]

### Parts
C73  0.1uF  CAP0603-CAP  [0603-CAP]
C74  1uF  CAP0603-CAP  [0603-CAP]
C75  0.1uF  CAP0603-CAP  [0603-CAP]
C76  10pF  CAP0603-CAP  [0603-CAP]
C77  47uF  CAP0805  [0805]
C78  4.7uF  CAP0603-CAP  [0603-CAP]
C79  1uF  CAP0603-CAP  [0603-CAP]
L8  2.2uH  IND-XFL4020  [XFL4020]
R54  18.2K  RESISTOR0603-RES  [0603-RES]
R55  300K  RESISTOR0603-RES  [0603-RES]
R56  49.9K  RESISTOR0603-RES  [0603-RES]
R57  1.0M  RESISTOR0603-RES  [0603-RES]
U7  LT8609A  [MSOP-10_MSE]

### Nets
3V3_BUS: C76.2 C77.1 C78.1 L8.2 R56.2 R57.2 ; also sheet 10,12,14
GND: C73.2 C74.2 C77.2 C78.2 C79.2 R54.1 R55.1 U7.5(SYNC) U7.11(GND) ; also sheet 2,3,4,5,6,7,8,9,10,12,13,14
PCM_IN_FILTERED: C79.1 U7.9(VIN) U7.10(EN) ; also sheet 6,7,8,9,10,12
U7_BST: C75.1 U7.1(BST)
U7_FB: C76.1 R55.2 R57.1 U7.6(FB)
U7_INTVCC: C74.1 U7.3(INTVCC)
U7_PG: R56.1 U7.8(PG)
U7_RT: R54.2 U7.4(RT)
U7_SW: C75.2 L8.1 U7.2(SW)
U7_TRSS: C73.1 U7.7(TRSS)

### Notes on the sheet
- 3A

## Sheet 12 of 14
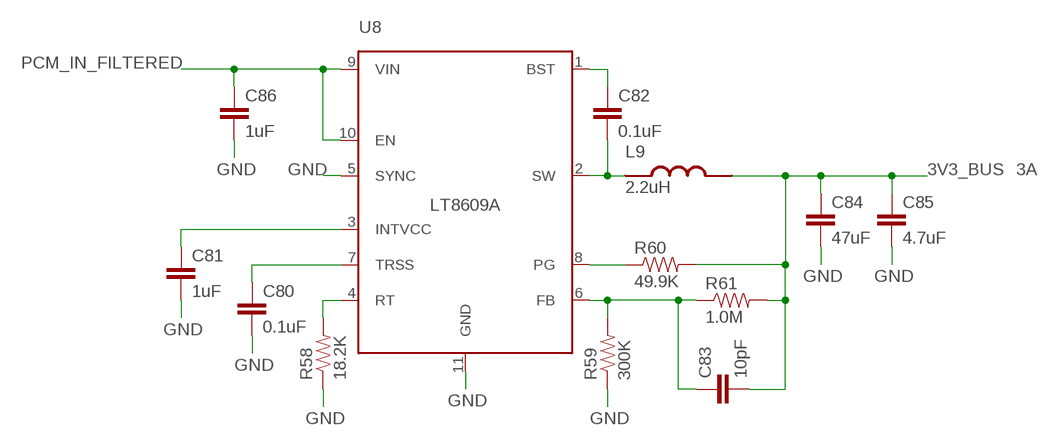
[diagram p11: schematic, sheet 12]

### Parts
C80  0.1uF  CAP0603-CAP  [0603-CAP]
C81  1uF  CAP0603-CAP  [0603-CAP]
C82  0.1uF  CAP0603-CAP  [0603-CAP]
C83  10pF  CAP0603-CAP  [0603-CAP]
C84  47uF  CAP0805  [0805]
C85  4.7uF  CAP0603-CAP  [0603-CAP]
C86  1uF  CAP0603-CAP  [0603-CAP]
L9  2.2uH  IND-XFL4020  [XFL4020]
R58  18.2K  RESISTOR0603-RES  [0603-RES]
R59  300K  RESISTOR0603-RES  [0603-RES]
R60  49.9K  RESISTOR0603-RES  [0603-RES]
R61  1.0M  RESISTOR0603-RES  [0603-RES]
U8  LT8609A  [MSOP-10_MSE]

### Nets
3V3_BUS: C83.2 C84.1 C85.1 L9.2 R60.2 R61.2 ; also sheet 10,11,14
GND: C80.2 C81.2 C84.2 C85.2 C86.2 R58.1 R59.1 U8.5(SYNC) U8.11(GND) ; also sheet 2,3,4,5,6,7,8,9,10,11,13,14
PCM_IN_FILTERED: C86.1 U8.9(VIN) U8.10(EN) ; also sheet 6,7,8,9,10,11
U8_BST: C82.1 U8.1(BST)
U8_FB: C83.1 R59.2 R61.1 U8.6(FB)
U8_INTVCC: C81.1 U8.3(INTVCC)
U8_PG: R60.1 U8.8(PG)
U8_RT: R58.2 U8.4(RT)
U8_SW: C82.2 L9.1 U8.2(SW)
U8_TRSS: C80.1 U8.7(TRSS)

### Notes on the sheet
- 3A

## Sheet 13 of 14
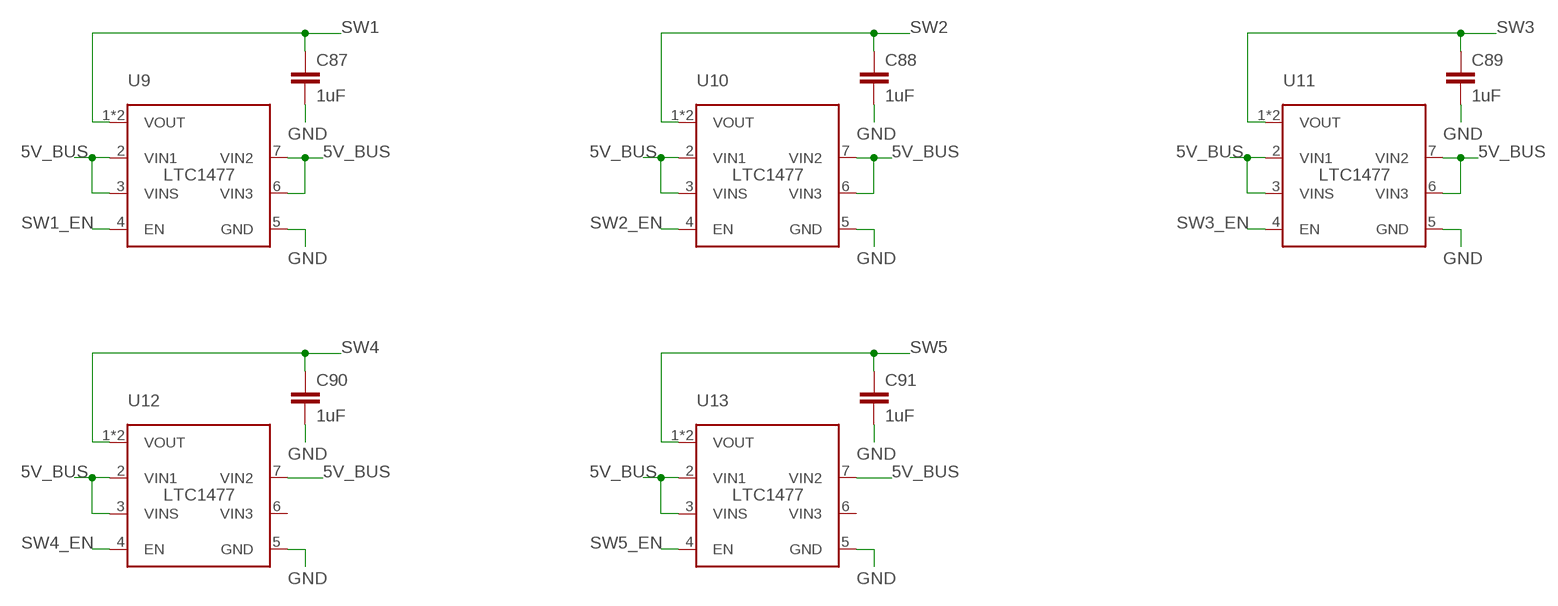
[diagram p12: schematic, sheet 13]

### Parts
C87  1uF  CAP0603-CAP  [0603-CAP]
C88  1uF  CAP0603-CAP  [0603-CAP]
C89  1uF  CAP0603-CAP  [0603-CAP]
C90  1uF  CAP0603-CAP  [0603-CAP]
C91  1uF  CAP0603-CAP  [0603-CAP]
U9  LTC1477  [SO8]
U10  LTC1477  [SO8]
U11  LTC1477  [SO8]
U12  LTC1477  [SO8]
U13  LTC1477  [SO8]

### Nets
5V_BUS: U9.2(VIN1) U9.3(VINS) U9.6(VIN3) U9.7(VIN2) U10.2(VIN1) U10.3(VINS) U10.6(VIN3) U10.7(VIN2) U11.2(VIN1) U11.3(VINS) U11.6(VIN3) U11.7(VIN2) U12.2(VIN1) U12.3(VINS) U12.7(VIN2) U13.2(VIN1) U13.3(VINS) U13.7(VIN2) ; also sheet 7,8,9
GND: C87.2 C88.2 C89.2 C90.2 C91.2 U9.5(GND) U10.5(GND) U11.5(GND) U12.5(GND) U13.5(GND) ; also sheet 2,3,4,5,6,7,8,9,10,11,12,14
SW1: C87.1 U9.1(VOUT) U9.8(VOUT)
SW1_EN: U9.4(EN)
SW2: C88.1 U10.1(VOUT) U10.8(VOUT)
SW2_EN: U10.4(EN)
SW3: C89.1 U11.1(VOUT) U11.8(VOUT)
SW3_EN: U11.4(EN)
SW4: C90.1 U12.1(VOUT) U12.8(VOUT)
SW4_EN: U12.4(EN)
SW5: C91.1 U13.1(VOUT) U13.8(VOUT)
SW5_EN: U13.4(EN)
Unconnected: U12.6(VIN3) U13.6(VIN3)

## Sheet 14 of 14
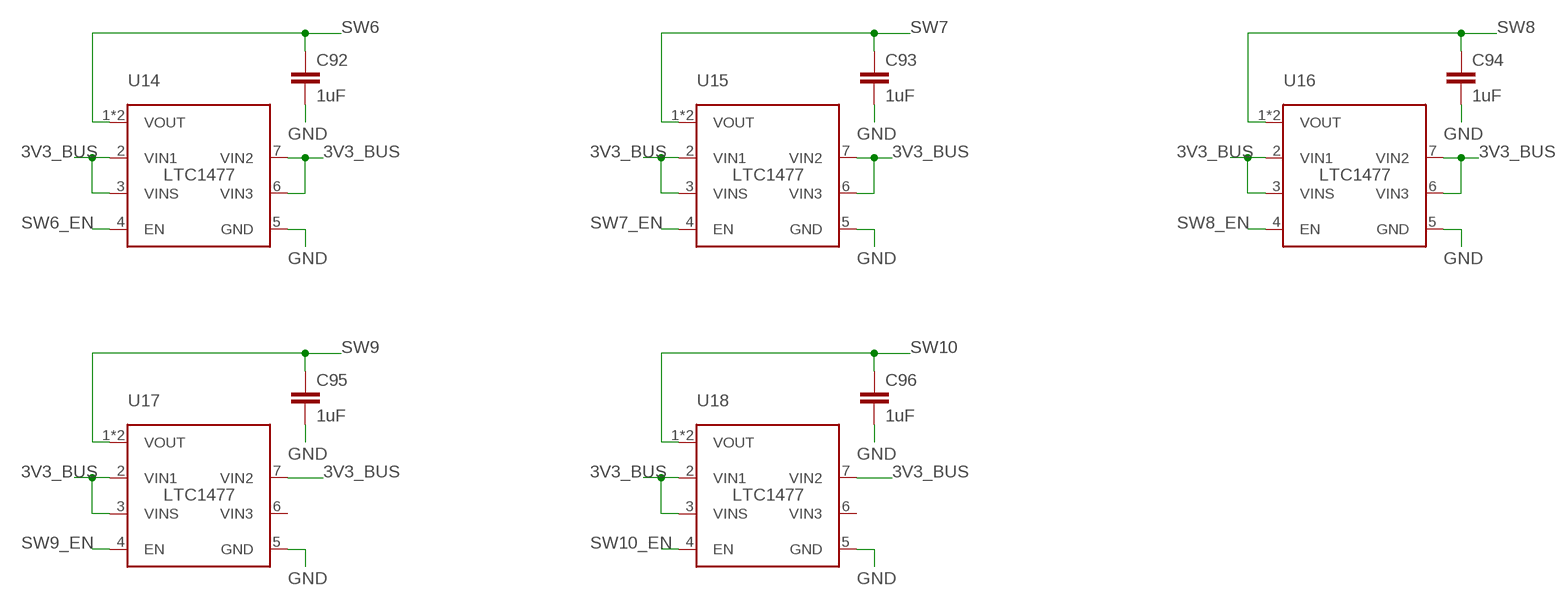
[diagram p13: schematic, sheet 14]

### Parts
C92  1uF  CAP0603-CAP  [0603-CAP]
C93  1uF  CAP0603-CAP  [0603-CAP]
C94  1uF  CAP0603-CAP  [0603-CAP]
C95  1uF  CAP0603-CAP  [0603-CAP]
C96  1uF  CAP0603-CAP  [0603-CAP]
U14  LTC1477  [SO8]
U15  LTC1477  [SO8]
U16  LTC1477  [SO8]
U17  LTC1477  [SO8]
U18  LTC1477  [SO8]

### Nets
3V3_BUS: U14.2(VIN1) U14.3(VINS) U14.6(VIN3) U14.7(VIN2) U15.2(VIN1) U15.3(VINS) U15.6(VIN3) U15.7(VIN2) U16.2(VIN1) U16.3(VINS) U16.6(VIN3) U16.7(VIN2) U17.2(VIN1) U17.3(VINS) U17.7(VIN2) U18.2(VIN1) U18.3(VINS) U18.7(VIN2) ; also sheet 10,11,12
GND: C92.2 C93.2 C94.2 C95.2 C96.2 U14.5(GND) U15.5(GND) U16.5(GND) U17.5(GND) U18.5(GND) ; also sheet 2,3,4,5,6,7,8,9,10,11,12,13
SW6: C92.1 U14.1(VOUT) U14.8(VOUT)
SW6_EN: U14.4(EN)
SW7: C93.1 U15.1(VOUT) U15.8(VOUT)
SW7_EN: U15.4(EN)
SW8: C94.1 U16.1(VOUT) U16.8(VOUT)
SW8_EN: U16.4(EN)
SW9: C95.1 U17.1(VOUT) U17.8(VOUT)
SW9_EN: U17.4(EN)
SW10: C96.1 U18.1(VOUT) U18.8(VOUT)
SW10_EN: U18.4(EN)
Unconnected: U17.6(VIN3) U18.6(VIN3)

## Library data of the parts
BCR1-BCR3 = DSD_Active_Library:MP2639A; BUILT_BY: Craig Opie; COPYRIGHT: Copyright (C) 2021 DSD. All rights reserved; DATASHEET: https://www.monolithicpower.com/en/documentview/productdocument/index/version/2/document_type/Datasheet/lang/en/sku/MP2639A/document_id/1451/; MANUFACTURER_PART_NUMBER: MP2639A; VENDOR: Monolithic Power Systems Inc
C1-C27 = DSD_Main_Library:CAP: Capacitor Standard 0603 ceramic capacitor, and 0.1" leaded capacitor.
C28-C43 C45-C98 = DSD_Passive_Library:CAP: Capacitor Standard 0603 ceramic capacitor, and 0.1" leaded capacitor.
C44 = DSD_Passive_Library:CAP_TANTALUM
D1-D3 = DSD_Passive_Library:DIODE
FB1 = DSD_Passive_Library:FB
H1 = DSD_Board_Library:PC104_WCONN
J1 J2 = DSD_Header_Library:USB-C: Type C, USB 3.1 Gen 2, Right Angle, Surface Mount (SMT) , USB Receptacle Buy Part <https://snapeda.com/parts/UJ31-CH-G1-SMT-TR/CUI%20Devices/view-part/?ref=eda>; AVAILABILITY: Warning; CUI_PURCHASE_URL: https://www.cuidevices.com/product/interconnect/connectors/usb-connectors/uj31-ch-g1-smt-tr?utm_source=snapeda.com&utm_medium=referral&utm_campaign=snapedaBOM; DESCRIPTION: Type C, USB 3.1 Gen 2, 5 A, Right Angle, Surface Mount (SMT) , USB Receptacle; DIGIKEY-PURCHASE-URL: https://snapeda.com/shop?store=DigiKey&id=2754415; MF: CUI Devices; MOUSER-PURCHASE-URL: https://snapeda.com/shop?store=Mouser&id=2754415; MP: UJ31-CH-G1-SMT-TR; PACKAGE: None; PRICE: None
L1-L9 = DSD_Passive_Library:IND
LED1-LED4 = DSD_Passive_Library:LED_0805
R1-R66 = DSD_Main_Library:RESISTOR: Resistor Basic schematic elements and footprints for 0603, 1206, and PTH resistors.
U1 = DSD_Controller_Library:MSP430FR6989IPN; AUTHOR: Craig Opie; COPYRIGHT: Copyright (C) 2021 DSD. All rights reserved.; DIGI-KEY_PART_NUMBER_1: 296-46524-5-ND; MANUFACTURER_PART_NUMBER: MSP430FR6989IPN; MFR_NAME: Texas Instruments
U2 = DSD_Regulator_Library:LP2985-N
U3-U8 = DSD_Regulator_Library:LT8609A
U9-U18 = DSD_Power_Distribution_Switches_Library:LTC1477
U19 = DSD_Passive_Library:TPS2115PW
X1 = DSD_Active_Library:MS3V-T1R; AUTHOR: Craig Opie